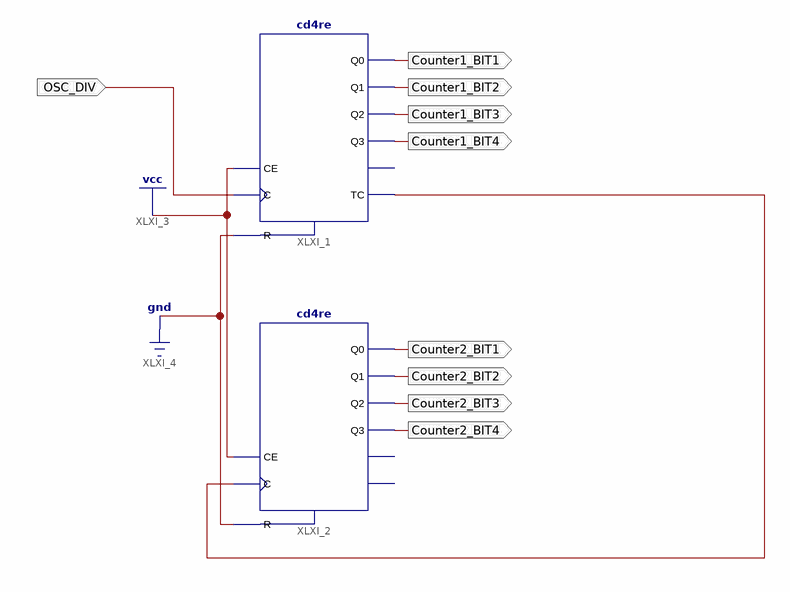
[diagram p0: schematic sheet 1]
// Xilinx ISE schematic Counters_fix.sch (spartan6) as structural Verilog: 2 symbols, 9 ports
module Counters_fix (
  input  OSC_DIV,
  output Counter1_BIT1,
  output Counter1_BIT2,
  output Counter1_BIT3,
  output Counter1_BIT4,
  output Counter2_BIT1,
  output Counter2_BIT2,
  output Counter2_BIT3,
  output Counter2_BIT4
);

  wire XLXN_8;

  cd4re XLXI_1 (
    .C(OSC_DIV), .CE(1'b1), .R(1'b0), .Q0(Counter1_BIT1), .Q1(Counter1_BIT2), .Q2(Counter1_BIT3),
    .Q3(Counter1_BIT4), .TC(XLXN_8));  // open: CEO
  cd4re XLXI_2 (
    .C(XLXN_8), .CE(1'b1), .R(1'b0), .Q0(Counter2_BIT1), .Q1(Counter2_BIT2), .Q2(Counter2_BIT3),
    .Q3(Counter2_BIT4));  // open: CEO, TC
endmodule
